# EAGLE design Sonar_Power_Schematic_LT1117 (EAGLE 8.7.1)
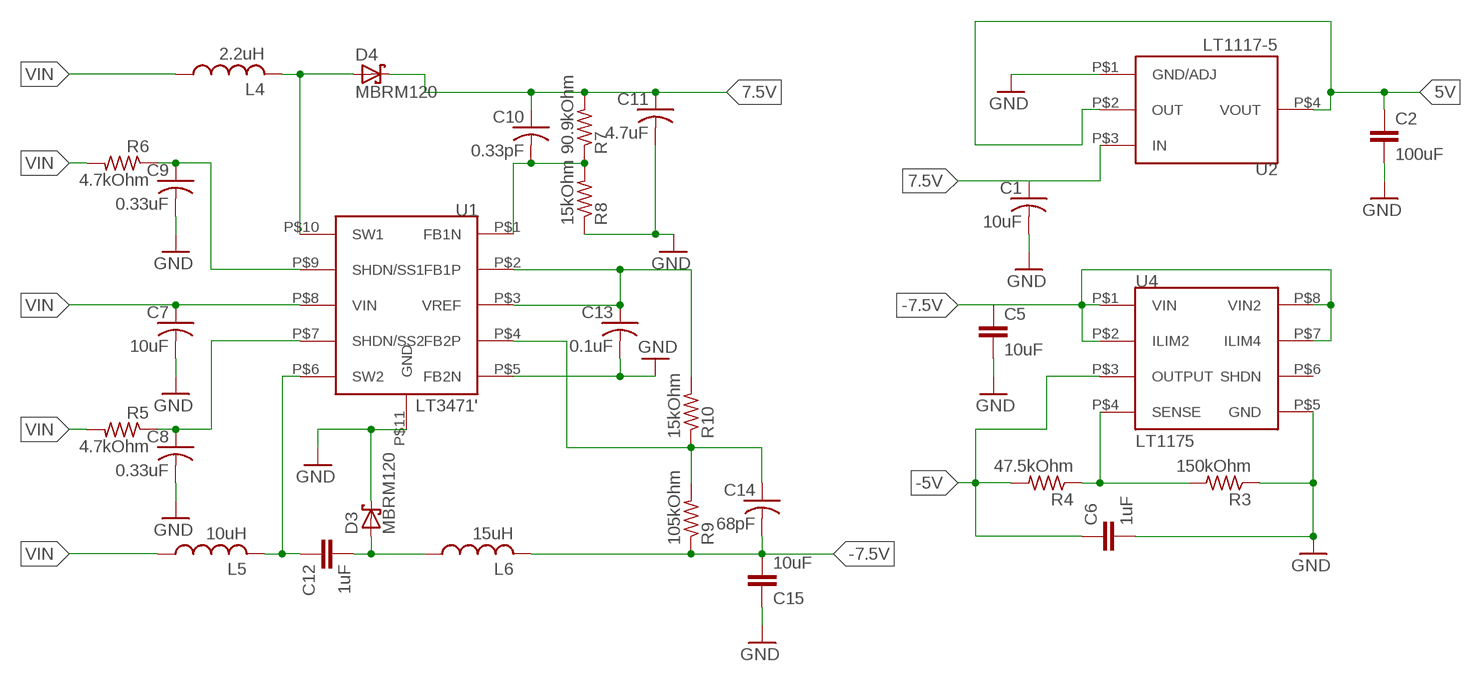
[diagram p0: schematic, sheet 1]

## Parts
C1  10uF  C-USC0603  [C0603]
C2  100uF  C-EUC1210  [C1210]
C5  10uF  C-EUC0603  [C0603]
C6  1uF  C-EUC1206  [C1206]
C7  10uF  C-USC0603  [C0603]
C8  0.33uF  C-USC0603  [C0603]
C9  0.33uF  C-USC0603  [C0603]
C10  0.33pF  C-USC0603  [C0603]
C11  4.7uF  C-USC0603  [C0603]
C12  1uF  C-EUC1206  [C1206]
C13  0.1uF  C-USC0603  [C0603]
C14  68pF  C-USC0603  [C0603]
C15  10uF  C-EUC0603  [C0603]
D3  MBRM120  [DO-216AA]
D4  MBRM120  [DO-216AA]
L4  2.2uH  LQH5BPN2R2N38L  [NS4.9X4.9]
L5  10uH  VLS5045EX-100M2  [NS5X5]
L6  15uH  VLS5045EX-150M-CA1  [NS5X5]
R3  150kOhm  R-US_R0603  [R0603]
R4  47.5kOhm  R-US_R0603  [R0603]
R5  4.7kOhm  R-US_R0603  [R0603]
R6  4.7kOhm  R-US_R0603  [R0603]
R7  90.9kOhm  R-US_R0603  [R0603]
R8  15kOhm  R-US_R0603  [R0603]
R9  105kOhm  R-US_R0603  [R0603]
R10  15kOhm  R-US_R0603  [R0603]
U1  LT3471'  [10-WFDFN]
U2  LT1117-5  [SOT233-3]
U4  LT1175  [8-SOIC]

## Nets
5V: C2.1 U2.P$2(OUT) U2.P$4(VOUT)
7.5V: C1.1 C10.1 C11.1 D4.P$1(C) R7.2 U2.P$3(IN)
-5V: C6.1 R4.2 U4.P$3(OUTPUT)
-7.5V: C5.1 C14.2 C15.2 L6.P$2 R9.1 U4.P$1(VIN) U4.P$2(ILIM2) U4.P$7(ILIM4) U4.P$8(VIN2)
GND: C1.2 C2.2 C5.2 C6.2 C7.2 C8.2 C9.2 C11.2 C13.2 C15.1 D3.P$1(C) R3.1 R8.1 U1.P$5(FB2N) U1.P$11(GND) U2.P$1(GND/ADJ) U4.P$5(GND)
N$9: R3.2 R4.1 U4.P$4(SENSE)
N$17: D4.P$2(A) L4.P$2 U1.P$10(SW1)
N$18: C10.2 R7.1 R8.2 U1.P$1(FB1N)
N$20: C12.1 L5.P$2 U1.P$6(SW2)
N$21: C12.2 D3.P$2(A) L6.P$1
N$26: C14.1 R9.2 R10.1 U1.P$4(FB2P)
SS1: C9.1 R6.1 U1.P$9(SHDN/SS1)
SS2: C8.1 R5.1 U1.P$7(SHDN/SS2)
VIN: C7.1 L4.P$1 L5.P$1 R5.2 R6.2 U1.P$8(VIN)
VREF: C13.1 R10.2 U1.P$2(FB1P) U1.P$3(VREF)
Unconnected: U4.P$6(SHDN)

## Library data of the parts
C1 C7-C11 C13 C14 = adafruit:C-US: CAPACITOR, American symbol
C2 C5 C6 C12 C15 = rcl:C-EU: CAPACITOR, European symbol; SPICEPREFIX: C
D3 D4 = Moira:MBRM120
L4 = Moira:LQH5BPN2R2N38L: 2.2uH
L5 = Moira:VLS5045EX-100M: VLS5045EX-100M, TDK 10uH, 445-174843-1-ND
L6 = Moira:VLS5045EX-150M-CA: VLS5045EX-150M-CA, TDK 15uH, 445-175141-1-ND
R3-R10 = adafruit:R-US_: RESISTOR, American symbol
U1 = Moira:LT3471: LT3471EDD#TRPBF
U2 = Moira:LT1117-5
U4 = Moira:LT1175: LT1175IS8#PBF

## Board
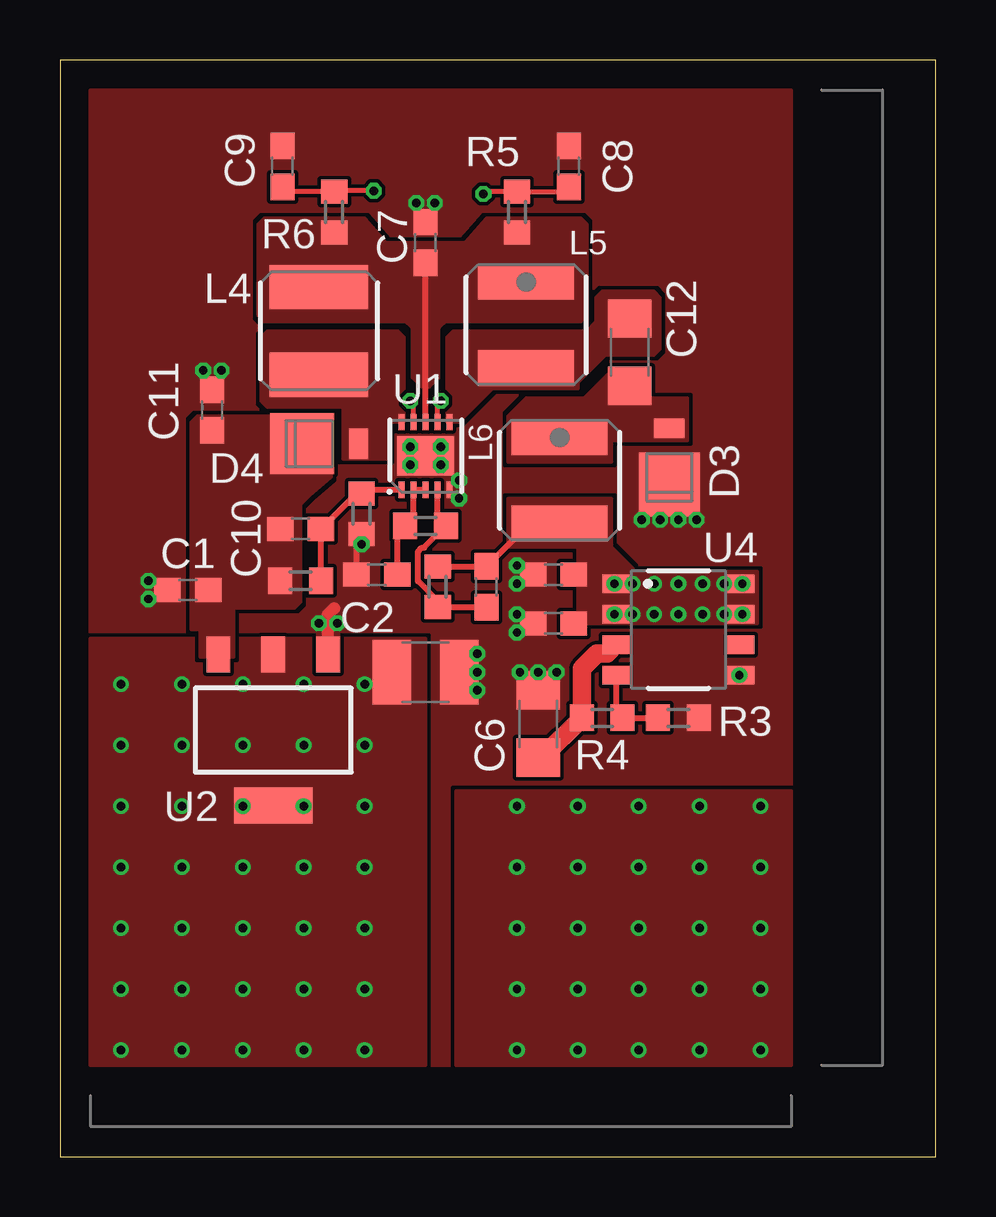
[diagram p1: board, top side]
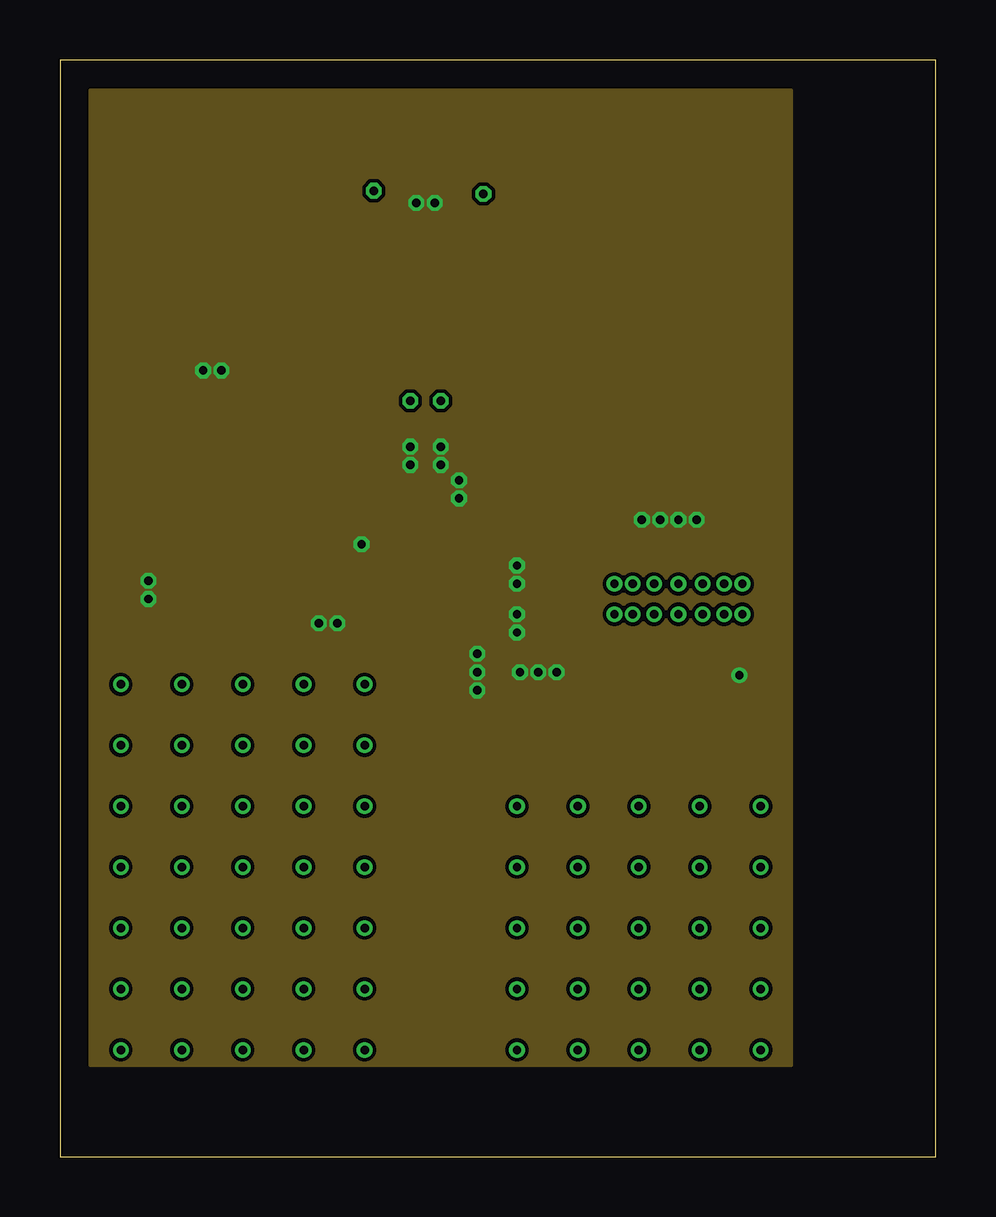
[diagram p2: board, inner layer Route2]
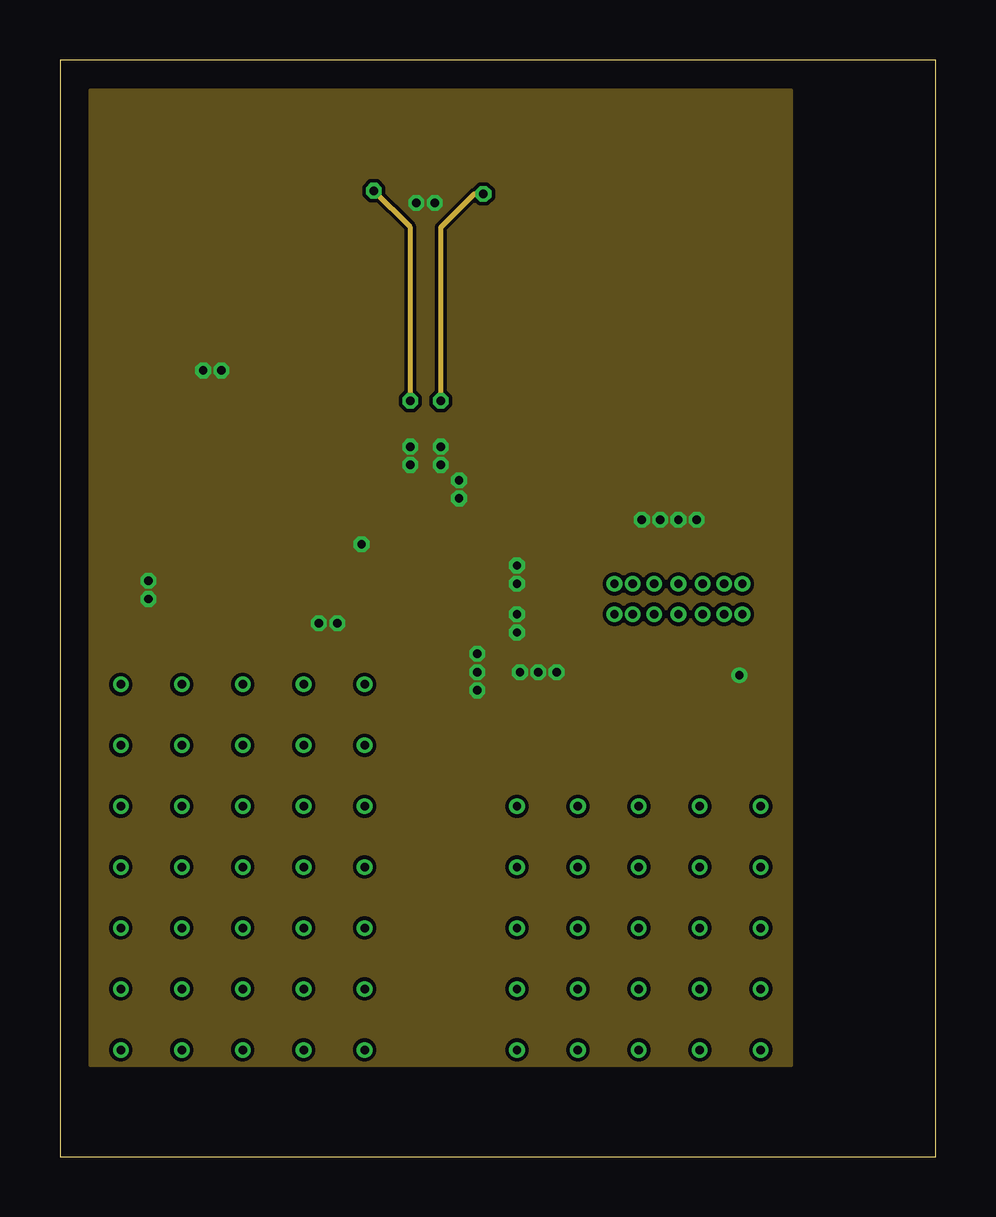
[diagram p3: board, inner layer Route15]
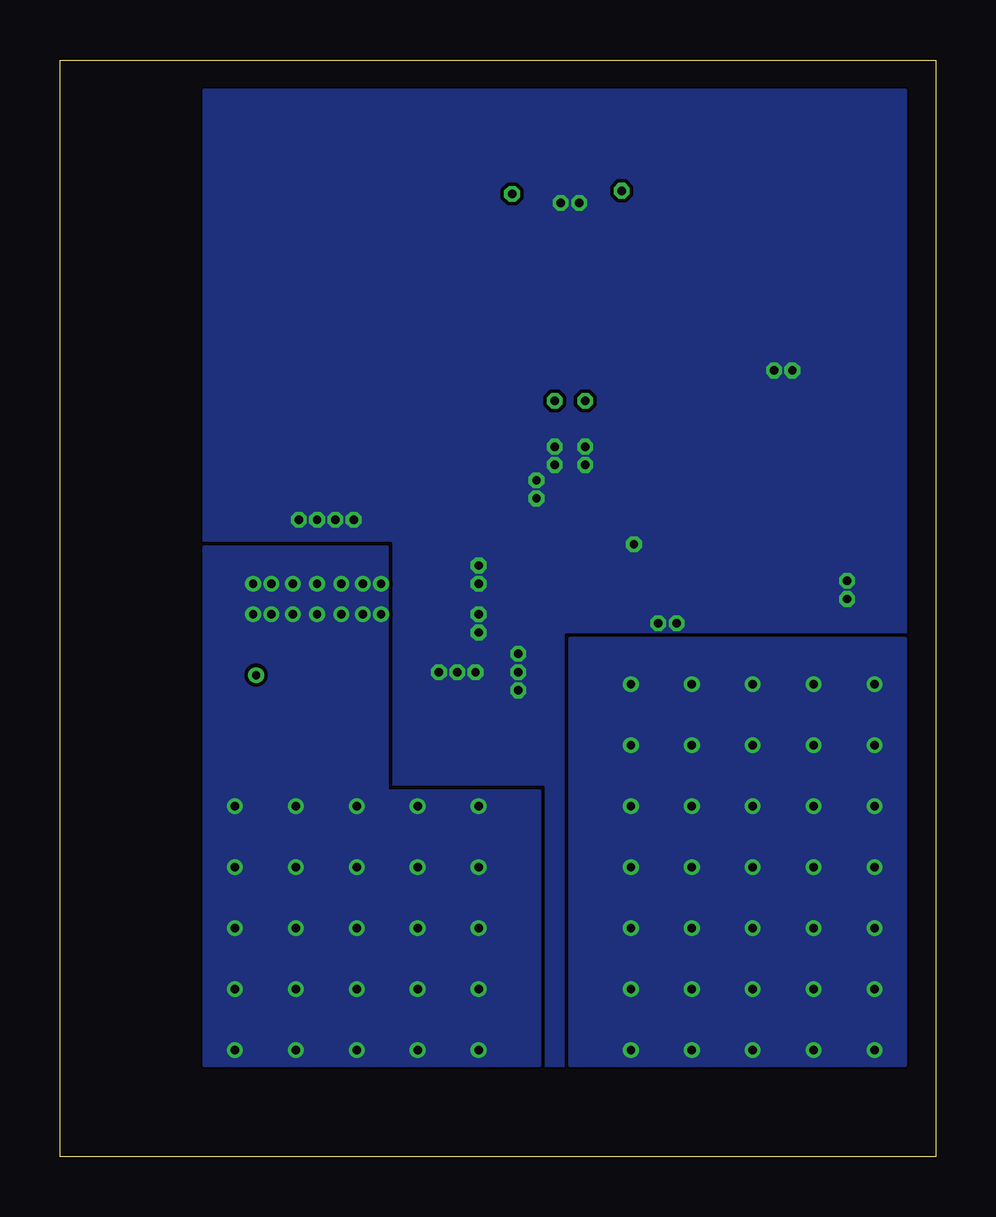
[diagram p4: board, bottom side, seen from below]

Size 36.5 x 45.71 mm. Coordinates in mm from the lower left corner, seen from the top.
Outline: 0,0 36.5,0 36.5,45.71 0,45.71 0,0
Copper layers (1*2*15*16): Top 0.035mm / dielectric 0.1702mm / Route2 0.0175mm / dielectric 47mil / Route15 0.0175mm / dielectric 0.1702mm / Bottom 0.035mm
Design rules "JLCPCB4Layer": minimum track width 6mil, minimum drill 10mil, track to track 6mil, track to pad 6mil, pad to pad 6mil, via to via 6mil, smd to smd 0mil, copper to edge 10mil, drill to drill 10mil, minimum pad ring 6mil, minimum via ring 6mil, stop-mask expansion 2mil, vias tented up to drill 100mil, thermal gap 10mil

### Footprints (pad centres in the part's own frame; a part is rotated, then mirrored left to right if it is on the bottom)
C0603 = smd 1.1 x 1: 1 -0.85,0; 2 0.85,0
C1210 = smd 1.6 x 2.7: 1 -1.4,0; 2 1.4,0
C1206 = smd 1.6 x 1.8: 1 -1.4,0; 2 1.4,0
DO-216AA = smd 2.67 x 2.54: P$1 -0.699,0 | smd 0.8 x 1.27: P$2 1.653,0
NS4.9X4.9 = smd 1.85 x 4.1: P$1 -1.825,0; P$2 1.825,0
NS5X5 = smd 1.5 x 4: P$1 -1.8,0; P$2 1.8,0
R0603 = smd 1 x 1.1: 1 -0.85,0; 2 0.85,0
10-WFDFN = smd 0.675 x 0.25: P$1 -1.413,1; P$2 -1.413,0.5; P$3 -1.413,0; P$4 -1.413,-0.5; P$5 -1.413,-1; P$6 1.413,-1; P$7 1.413,-0.5; P$8 1.413,0; P$9 1.413,0.5; P$10 1.413,1 | smd 1.65 x 2.38: P$11 0,0
SOT233-3 = smd 0.991 x 1.499: P$1 -2.286,-3.15; P$2 0,-3.15; P$3 2.286,-3.15 | smd 3.277 x 1.499: P$4 0,3.15
8-SOIC = smd 1.143 x 0.762: P$1 -2.603,1.905; P$2 -2.603,0.635; P$3 -2.603,-0.635; P$4 -2.603,-1.905; P$5 2.603,-1.905; P$6 2.603,-0.635; P$7 2.603,0.635; P$8 2.603,1.905

### Placement (x,y rotation side)
C1  5.33,23.62 180 top
C2  15.24,20.19 0 top
C5  20.57,24.26 180 top
C6  19.94,18.03 90 top
C7  15.24,38.1 90 top
C8  21.21,41.28 90 top
C9  9.27,41.28 90 top
C10  10.03,26.16 0 top
C11  6.35,31.12 90 top
C12  23.75,33.53 270 top
C13  13.21,24.26 180 top
C14  17.78,23.75 90 top
C15  20.57,22.23 0 top
D3  25.4,28.7 90 top
D4  10.79,29.72 0 top
L4  10.79,34.42 270 top
L5  19.43,34.67 270 top
L6  20.83,28.19 270 top
R3  25.78,18.29 180 top
R4  22.61,18.29 180 top
R5  19.05,39.37 270 top
R6  11.43,39.37 270 top
R7  10.03,24 180 top
R8  12.57,26.8 90 top
R9  15.75,23.75 270 top
R10  15.24,26.29 180 top
U1  15.24,29.21 90 top
U2  8.89,17.78 180 top
U4  25.78,21.97 0 top

### Tracks (layer width: path | path; a pad name or v marks a point on that pad's centre or on a via)
5V  (via drill 0.35)
  other vias: 2.54,12.07 5.08,12.07 7.62,12.07 10.16,12.07 12.7,12.07 12.7,14.61 10.16,14.61 7.62,14.61 5.08,14.61 2.54,14.61 12.7,17.15 10.16,17.15 7.62,17.15 5.08,17.15 2.54,17.15 12.7,19.69 10.16,19.69 7.62,19.69 5.08,19.69 2.54,19.69 2.54,9.53 5.08,9.53 7.62,9.53 10.16,9.53 12.7,9.53 2.54,6.99 5.08,6.99 7.62,6.99 10.16,6.99 12.7,6.99 2.54,4.45 5.08,4.45 7.62,4.45 10.16,4.45 12.7,4.45
  pour Top (rank 2, no thermals): 1.27,3.81 1.27,21.59 15.24,21.59 15.24,3.81
  pour Bottom (rank 2, no thermals): 1.27,3.81 1.27,21.59 15.24,21.59 15.24,3.81
7.5V
  pour Top (no thermals): 11.3,30.86 5.71,30.86 5.46,30.61 5.46,21.97 5.84,21.97 5.84,20.83 7.24,20.83 7.24,22.86 9.78,22.86 10.03,23.11 10.03,27.18 10.41,27.56 11.3,28.32
-5V
  Top 0.762: U4.P$3 22.82,20.98 22.38,20.98 21.76,20.35 R4.2 20.1,16.63 C6.1
-7.5V  (via drill 0.35)
  Top 0.254: R9.1 C14.2 19.57,26.39 L6.P$2
  other vias: 19.05,12.07 21.59,12.07 24.13,12.07 26.67,12.07 29.21,12.07 29.21,14.61 26.67,14.61 24.13,14.61 21.59,14.61 19.05,14.61 19.05,9.53 21.59,9.53 24.13,9.53 26.67,9.53 29.21,9.53 19.05,6.99 21.59,6.99 24.13,6.99 26.67,6.99 29.21,6.99 19.05,4.45 21.59,4.45 24.13,4.45 26.67,4.45 29.21,4.45 23.88,23.88 23.88,22.61 27.69,22.61 27.69,23.88 23.11,23.88 23.11,22.61 28.45,22.61 28.45,23.88 24.77,23.88 24.77,22.61 25.78,22.61 25.78,23.88 26.8,23.88 26.8,22.61
  pour Top (no thermals): 22.99,25.4 22.99,27.43 18.67,27.43 18.67,25.4 21.59,25.4 21.59,22.23 29.08,22.23 29.08,24.38 23.88,24.38 23.88,24.51
  pour Bottom (rank 2, no thermals): 16.51,3.81 16.51,15.24 22.86,15.24 22.86,25.4 30.48,25.4 30.48,3.81
  pour Top (rank 2, no thermals): 16.51,3.81 16.51,15.24 30.48,15.24 30.48,3.81
GND  (via drill 0.35)
  Top 0.254: 16.26,27.81 U1.P$5 | C13.2 12.36,25.73 R8.1 v12.57,25.53
  Top 0.508: U2.P$1 11.18,22.61 11.43,22.86
  other vias: 19.05,22.61 14.86,39.75 19.05,23.88 19.05,24.64 5.97,32.77 25.78,26.54 14.61,29.59 15.88,29.59 24.26,26.54 26.54,26.54 10.79,22.23 17.4,20.19 17.4,20.96 3.68,24 14.61,28.83 15.88,28.83 15.62,39.75 6.73,32.77 3.68,23.24 11.56,22.23 19.05,21.84 25.02,26.54 17.4,19.43 16.64,28.19 19.94,20.19 19.18,20.19 20.7,20.19 16.64,27.43 28.32,20.07
  pour Top (no thermals): 14.48,41.02 14.22,40.77 14.22,38.73 14.48,38.48 16,38.48 16.26,38.73 16.26,40.77 16,41.02
  pour Route15 (rank 3): 1.27,44.45 30.48,44.45 30.48,3.81 1.27,3.81
  pour Top: 8.38,42.8 8.38,41.78 8.64,41.53 11.43,41.53 11.68,41.78 11.68,42.8 11.43,43.05 8.64,43.05
  pour Bottom (rank 3, no thermals): 1.27,44.45 1.27,3.81 30.48,3.81 30.48,44.45
  pour Top: 19.43,43.05 19.18,42.8 19.18,41.78 19.43,41.53 22.1,41.53 22.35,41.78 22.35,42.8 22.1,43.05
  pour Top (rank 2, no thermals): 5.71,33.27 6.98,33.27 7.24,33.02 7.24,31.12 5.46,31.12 5.46,33.02
  pour Top (no thermals): 23.75,29.21 24.13,29.46 26.8,29.46 27.05,29.21 27.05,25.78 26.8,25.53 24,25.53 23.75,25.78
  pour Top (rank 2, no thermals): 3.18,22.99 3.18,24.26 3.43,24.51 5.21,24.51 5.21,22.73 3.43,22.73
  pour Top (rank 3, no thermals): 1.27,44.45 1.27,3.81 30.48,3.81 30.48,44.45
  pour Route2 (rank 3, no thermals): 1.27,44.45 1.27,3.81 30.48,3.81 30.48,44.45
N$9
  Top 0.254: U4.P$4 23.18,18.57 R4.1 R3.2
N$17
  pour Top (no thermals): 14.35,34.16 14.35,30.61 13.72,30.61 13.72,29.08 11.81,29.08 11.81,31.24 8.64,31.24 8.38,31.5 8.38,34.16 8.64,34.42 14.1,34.42
N$18
  Top 0.254: U1.P$1 12.72,27.8 R8.2 12.37,27.65 C10.2 R7.1
N$20
  pour Top (no thermals): 21.59,32 18.03,32 16.64,30.61 16.13,30.61 16.13,34.16 16.38,34.42 21.97,34.42 22.35,34.8 22.35,35.81 22.61,36.07 24.77,36.07 25.02,35.81 25.02,33.66 24.77,33.4 22.73,33.4 21.59,32.26
N$21
  pour Top (no thermals): 22.99,28.96 22.99,29.85 26.16,29.85 26.16,31.62 24.51,31.62 24.51,32.77 22.99,32.77 21.84,31.62 19.43,31.62 18.67,30.86 18.67,28.96
N$26
  Top 0.254: U1.P$4 15.74,26.64 R10.1 15.18,25.38 15.08,25.38 14.92,25.21 14.92,23.98 15.75,23.15 R9.2 C14.1
SS1  (via drill 0.35)
  Top 0.203: U1.P$9 14.74,31.36 v14.61,31.5 | v13.08,40.26 11.47,40.26 R6.1 9.48,40.22 C9.1
  Route15 0.203: v14.61,31.5 14.61,38.73 v13.08,40.26
SS2  (via drill 0.35)
  Top 0.203: U1.P$7 15.74,31.36 v15.88,31.5 | v17.65,40.13 17.74,40.22 R5.1 21,40.22 C8.1
  Route15 0.203: v15.88,31.5 15.88,38.73 17.27,40.13 v17.65,40.13
VIN
  Top 0.254: U1.P$8 C7.1
  pour Top (no thermals): 8.25,38.86 8.25,35.05 8.51,34.8 21.72,34.8 21.97,35.05 21.97,38.86 21.72,39.12 17.78,39.12 16.89,38.1 13.59,38.1 12.7,39.12 8.51,39.12
  pour Top: 14.73,34.54 14.73,32.51 15.11,32.13 15.37,32.13 15.75,32.51 15.75,34.54 16.13,34.93 16.13,37.85 14.48,37.85 14.35,37.72 14.35,34.93
VREF
  Top 0.254: U1.P$3 U1.P$2 14.74,26.64 R10.2 14.06,25.96 C13.1